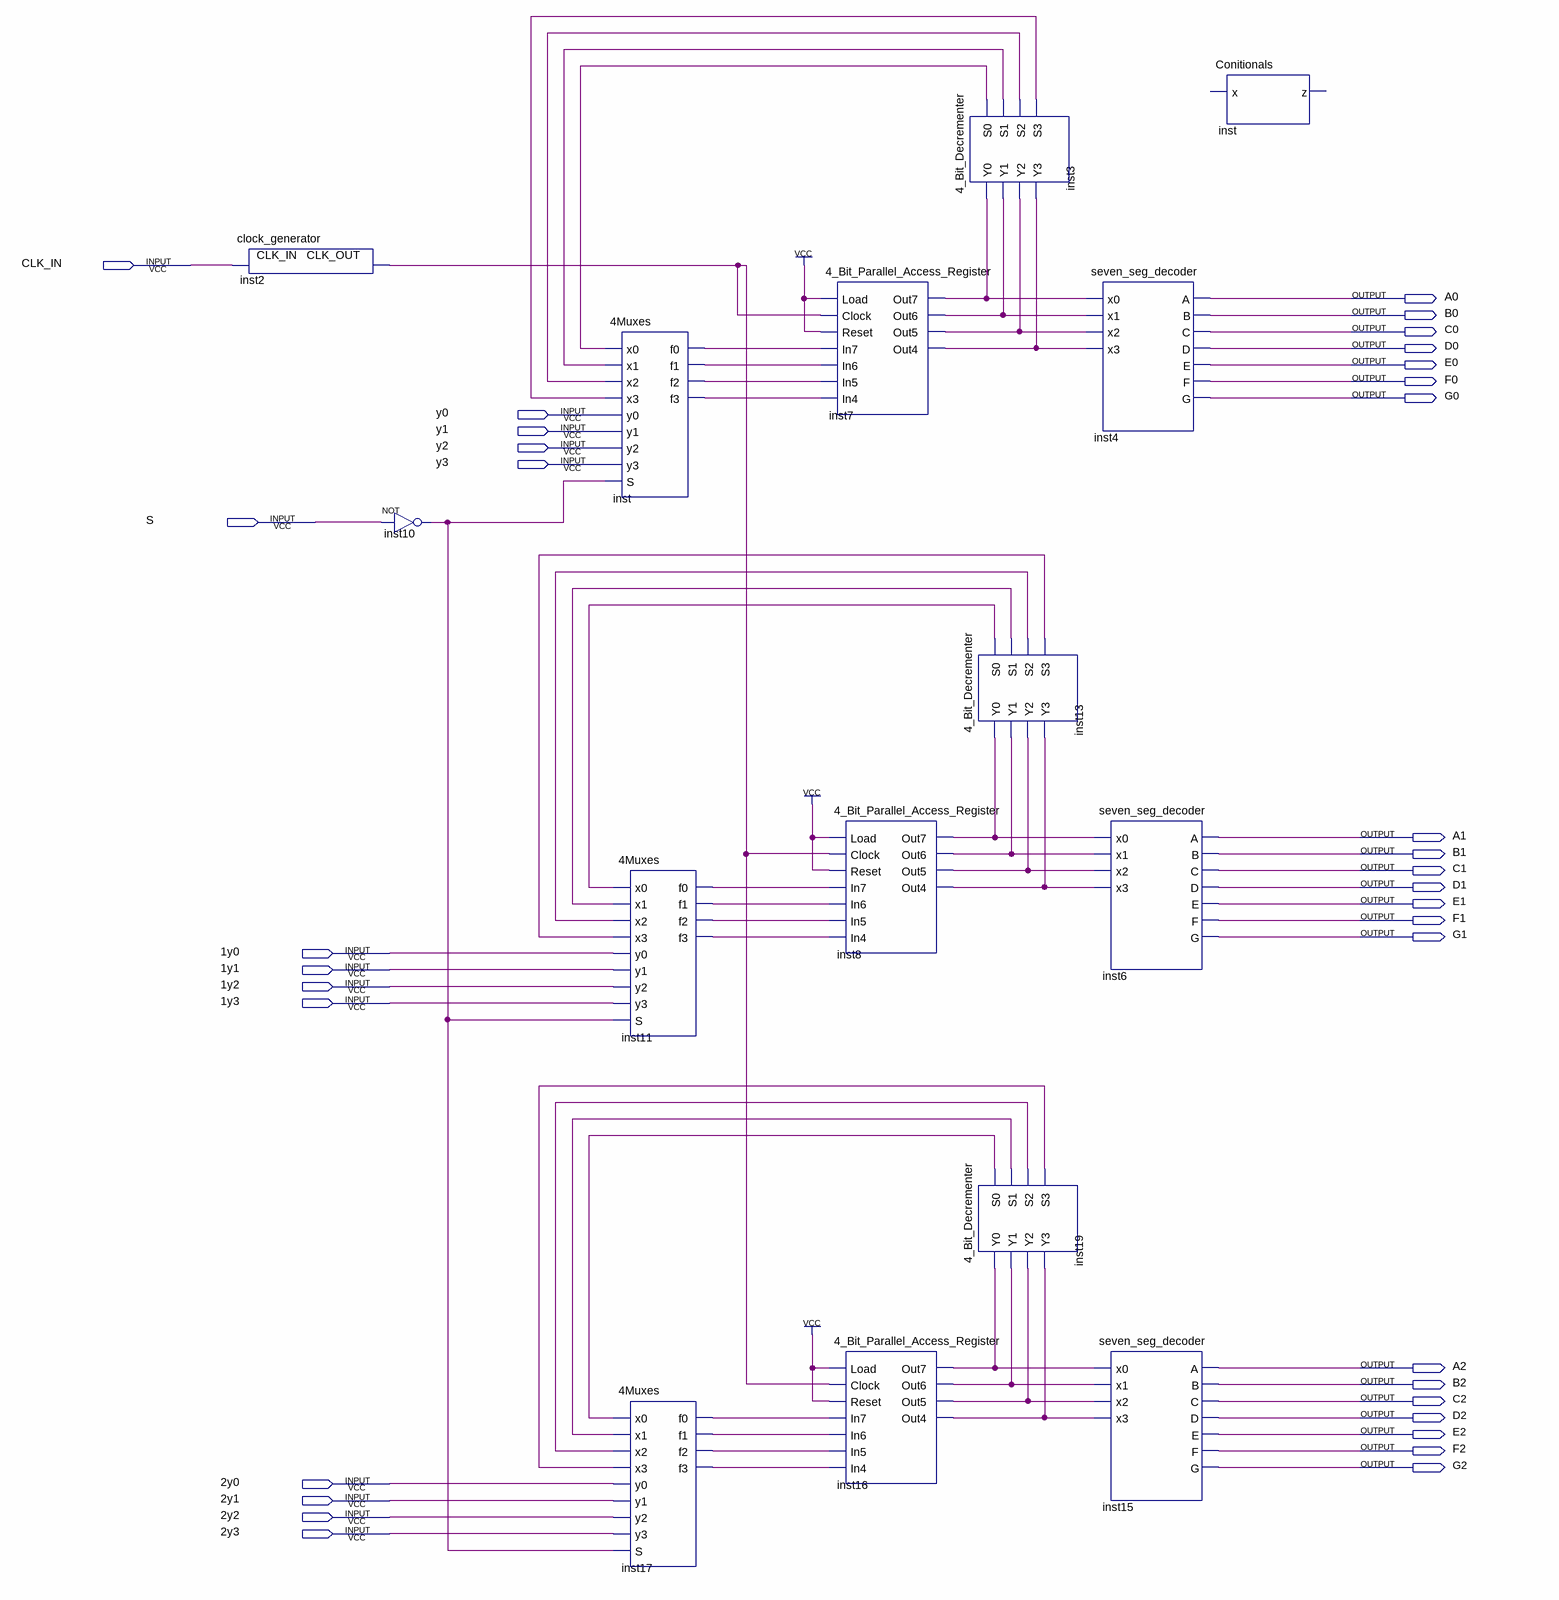
[diagram p0: schematic sheet]
// Quartus schematic Testing4BitDecrementer.bdf as structural Verilog: 15 symbols, 35 pins
module Testing4BitDecrementer (
  input  CLK_IN,
  input  y0,
  input  y1,
  input  y2,
  input  y3,
  input  S,
  input  \1y0 ,
  input  \1y1 ,
  input  \1y2 ,
  input  \1y3 ,
  input  \2y0 ,
  input  \2y1 ,
  input  \2y2 ,
  input  \2y3 ,
  output A0,
  output B0,
  output C0,
  output D0,
  output E0,
  output F0,
  output G0,
  output A1,
  output B1,
  output C1,
  output D1,
  output E1,
  output F1,
  output G1,
  output A2,
  output B2,
  output C2,
  output D2,
  output E2,
  output F2,
  output G2
);

  wire inst2_clk_out, inst3_s0, inst3_s1, inst3_s2, inst3_s3, inst7_out4, inst7_out5, inst7_out6, inst7_out7,
       inst8_out4, inst8_out5, inst8_out6, inst8_out7, inst10_out, inst11_f0, inst11_f1, inst11_f2,
       inst11_f3, inst13_s0, inst13_s1, inst13_s2, inst13_s3, inst16_out4, inst16_out5, inst16_out6,
       inst16_out7, inst17_f0, inst17_f1, inst17_f2, inst17_f3, inst19_s0, inst19_s1, inst19_s2, inst19_s3,
       inst_f0, inst_f1, inst_f2, inst_f3;

  clock_generator inst2 (.CLK_IN(CLK_IN), .CLK_OUT(inst2_clk_out));
  not inst10 (inst10_out, S);
  \4Muxes  inst (
    .S(inst10_out), .x0(inst3_s0), .x1(inst3_s1), .x2(inst3_s2), .x3(inst3_s3), .y0(y0), .y1(y1), .y2(y2),
    .y3(y3), .f0(inst_f0), .f1(inst_f1), .f2(inst_f2), .f3(inst_f3));
  \4Muxes  inst11 (
    .S(inst10_out), .x0(inst13_s0), .x1(inst13_s1), .x2(inst13_s2), .x3(inst13_s3), .y0(\1y0 ), .y1(\1y1 ),
    .y2(\1y2 ), .y3(\1y3 ), .f0(inst11_f0), .f1(inst11_f1), .f2(inst11_f2), .f3(inst11_f3));
  \4Muxes  inst17 (
    .S(inst10_out), .x0(inst19_s0), .x1(inst19_s1), .x2(inst19_s2), .x3(inst19_s3), .y0(\2y0 ), .y1(\2y1 ),
    .y2(\2y2 ), .y3(\2y3 ), .f0(inst17_f0), .f1(inst17_f1), .f2(inst17_f2), .f3(inst17_f3));
  \4_Bit_Parallel_Access_Register  inst7 (
    .Load(1'b1), .Clock(inst2_clk_out), .Reset(1'b1), .In7(inst_f0), .In6(inst_f1), .In5(inst_f2),
    .In4(inst_f3), .Out7(inst7_out7), .Out6(inst7_out6), .Out5(inst7_out5), .Out4(inst7_out4));
  \4_Bit_Parallel_Access_Register  inst8 (
    .Load(1'b1), .Clock(inst2_clk_out), .Reset(1'b1), .In7(inst11_f0), .In6(inst11_f1), .In5(inst11_f2),
    .In4(inst11_f3), .Out7(inst8_out7), .Out6(inst8_out6), .Out5(inst8_out5), .Out4(inst8_out4));
  \4_Bit_Parallel_Access_Register  inst16 (
    .Load(1'b1), .Clock(inst2_clk_out), .Reset(1'b1), .In7(inst17_f0), .In6(inst17_f1), .In5(inst17_f2),
    .In4(inst17_f3), .Out7(inst16_out7), .Out6(inst16_out6), .Out5(inst16_out5), .Out4(inst16_out4));
  \4_Bit_Decrementer  inst3 (
    .Y0(inst7_out7), .Y1(inst7_out6), .Y2(inst7_out5), .Y3(inst7_out4), .S0(inst3_s0), .S1(inst3_s1),
    .S2(inst3_s2), .S3(inst3_s3));
  \4_Bit_Decrementer  inst13 (
    .Y0(inst8_out7), .Y1(inst8_out6), .Y2(inst8_out5), .Y3(inst8_out4), .S0(inst13_s0), .S1(inst13_s1),
    .S2(inst13_s2), .S3(inst13_s3));
  \4_Bit_Decrementer  inst19 (
    .Y0(inst16_out7), .Y1(inst16_out6), .Y2(inst16_out5), .Y3(inst16_out4), .S0(inst19_s0), .S1(inst19_s1),
    .S2(inst19_s2), .S3(inst19_s3));
  seven_seg_decoder inst4 (
    .x0(inst7_out7), .x1(inst7_out6), .x2(inst7_out5), .x3(inst7_out4), .A(A0), .B(B0), .C(C0), .D(D0),
    .E(E0), .F(F0), .G(G0));
  seven_seg_decoder inst6 (
    .x0(inst8_out7), .x1(inst8_out6), .x2(inst8_out5), .x3(inst8_out4), .A(A1), .B(B1), .C(C1), .D(D1),
    .E(E1), .F(F1), .G(G1));
  seven_seg_decoder inst15 (
    .x0(inst16_out7), .x1(inst16_out6), .x2(inst16_out5), .x3(inst16_out4), .A(A2), .B(B2), .C(C2), .D(D2),
    .E(E2), .F(F2), .G(G2));
  Conitionals inst_dup2 ();  // open: x, z
endmodule
